# Altium schematic sheet Top Level.SchDoc
size A4
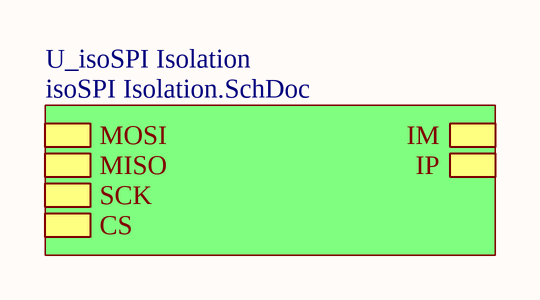
[diagram p0: Top Level.SchDoc]

## Sub-sheets
U_isoSPI Isolation = isoSPI Isolation.SchDoc: IP, IM, MOSI, MISO, SCK, CS